# Altium project Dimming_IR_VLC.PrjPcb
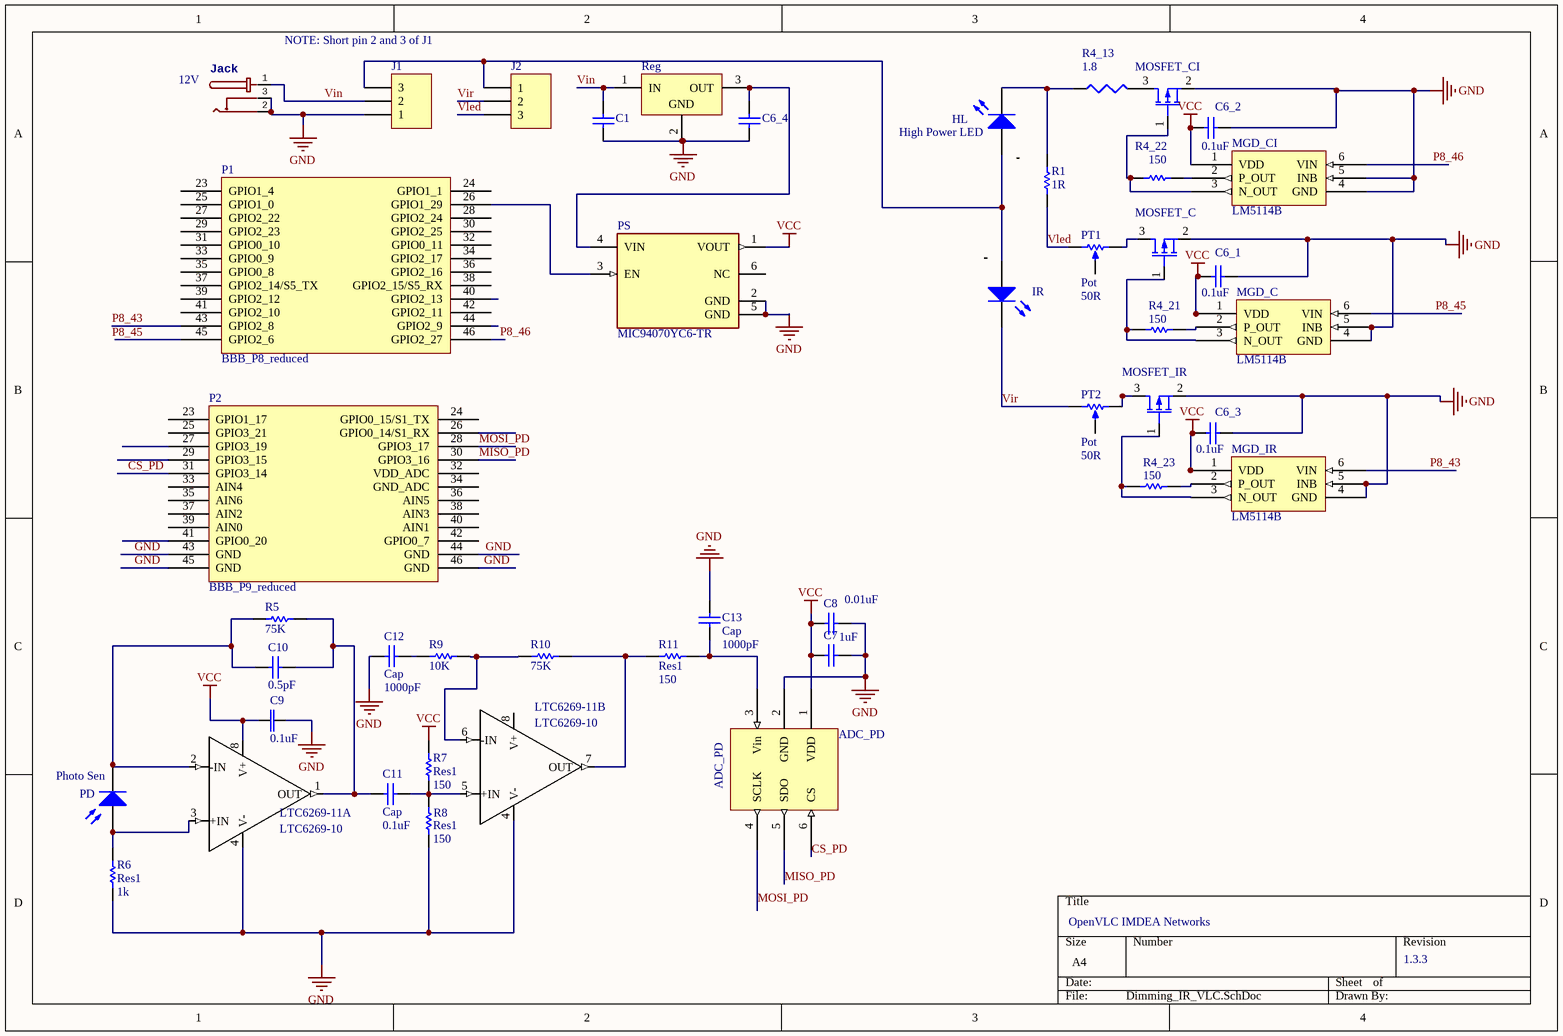
[diagram p0: Dimming_IR_VLC.SchDoc]
1 sheet, 44 parts. Net scope: global (net labels, ports and power ports of the same name join across sheets).
Board file: Dimming_IR_VLC.PcbDoc

## Sheet Dimming_IR_VLC.SchDoc
size A4; SheetNumber: 1; SheetTotal: 1

### Parts
ADC_PD  ADC_PD  [SOT23-6]
C1  Cap  [1608[0603]]  (value not drawn)
C6_1  value 0.1uF  [1608[0603]]  (hidden comment: Cap)
C6_2  value 0.1uF  [1608[0603]]  (hidden comment: Cap)
C6_3  value 0.1uF  [1608[0603]]  (hidden comment: Cap)
C6_4  Cap  [1608[0603]]  (value not drawn)
C7  value 1uF  [1608[0603]]  (hidden comment: Cap)
C8  value 0.01uF  [1608[0603]]  (hidden comment: Cap)
C9  value 0.1uF  [1608[0603]]  (hidden comment: Cap)
C10  value 0.5pF  [1608[0603]]  (hidden comment: Cap)
C11  Cap  value 0.1uF  [1608[0603]]
C12  Cap  value 1000pF  [1608[0603]]
C13  Cap  value 1000pF  [1608[0603]]
HL  High Power LED  [LEDM345X345X226]
IR  (no value)  [LEDM345X345X226]
J1  (no value)  [MHDR1X3]
J2  (no value)  [MHDR1X3]
Jack  2.0 mm Center Pin, 2.5 A, Right Angle, Through Hole, Tapered Pins, Dc Power Jack Connector  [CUI_PJ-102A]  (value not drawn)
LTC6269-11  LTC6269-10  [SM8]  (parts A,B of 2)
MGD_C  LM5114B  [SOT23-6_N]
MGD_CI  LM5114B  [SOT23-6_N]
MGD_IR  LM5114B  [SOT23-6_N]
MOSFET_C  MOSFET  [SOT23-3]  (value not drawn)
MOSFET_CI  MOSFET  [SOT23-3]  (value not drawn)
MOSFET_IR  MOSFET  [SOT23-3]  (value not drawn)
P1  BBB_P8_reduced  [BBB_CAPE_NO_HEADER_R_24]
P2  BBB_P9_reduced  [BBB_CAPE_NO_HEADER_R_24]
PD  Photo Sen  [HDR1X2]
PS  MIC94070YC6-TR  [FP-SC70-6LD-PL-1-IPC_A]
PT1  Pot  value 50R  [VR5]
PT2  Pot  value 50R  [VR5]
R1  1R  [1608[0603]]
R4_13  value 1.8  [14-1210]  (hidden comment: Res3)
R4_21  value 150  [1608[0603]]  (hidden comment: Res1)
R4_22  value 150  [1608[0603]]  (hidden comment: Res1)
R4_23  value 150  [1608[0603]]  (hidden comment: Res1)
R5  value 75K  [1608[0603]]  (hidden comment: Res1)
R6  Res1  value 1k  [1608[0603]]
R7  Res1  value 150  [1608[0603]]
R8  Res1  value 150  [1608[0603]]
R9  value 10K  [1608[0603]]  (hidden comment: Res1)
R10  value 75K  [1608[0603]]  (hidden comment: Res1)
R11  Res1  value 150  [1608[0603]]
Reg  LM340T-5.0  [NDE0003A]  (value not drawn)

### Nets
GND: ADC_PD.2(GND) C1.1 C6_1.2 C6_2.2 C6_3.2 C6_4.1 C7.2 C8.2 C9.1 C12.1 C13.2 J1.1 Jack.2 Jack.3 LTC6269-11.4(V-) MGD_C.4(GND) MGD_C.5(INB) MGD_CI.4(GND) MGD_CI.5(INB) MGD_IR.4(GND) MGD_IR.5(INB) MOSFET_C.2(S) MOSFET_CI.2(S) MOSFET_IR.2(S) P2.43(GND) P2.44(GND) P2.45(GND) P2.46(GND) PS.2(GND) PS.5(GND) R6.1 R8.1 Reg.2(GND)
VCC: ADC_PD.1(VDD) C6_1.1 C6_2.1 C6_3.1 C7.1 C8.1 C9.2 LTC6269-11.8(V+) MGD_C.1(VDD) MGD_CI.1(VDD) MGD_IR.1(VDD) PS.1(VOUT) R7.2
CS_PD: ADC_PD.6(CS) P2.31(GPIO3_14)
MISO_PD: ADC_PD.5(SDO) P2.30(GPIO3_16)
MOSI_PD: ADC_PD.4(SCLK) P2.28(GPIO3_17)
P8_43: MGD_IR.6(VIN) P1.43(GPIO2_8)
P8_45: MGD_C.6(VIN)
P8_46: MGD_CI.6(VIN) P1.46(GPIO2_27)
Vin: C1.2 J1.2 Jack.1 Reg.1(IN)
Vir: IR.2(K) J2.2 PT2.1(TOP)
Vled: J2.3 PT1.1(TOP) R1.1
NetADC_PD_3: ADC_PD.3(Vin) C13.1 R11.1
NetC6_4_2: C6_4.2 PS.4(VIN) Reg.3(OUT)
NetC10_1: C10.1 LTC6269-11.2(-IN) PD.2(K) R5.1
NetC10_2: C10.2 C11.1 LTC6269-11.1(OUT) R5.2
NetC11_2: C11.2 LTC6269-11.5(+IN) R7.1 R8.2
NetC12_2: C12.2 R9.2
NetHL_1: HL.1(A) IR.1(A) J1.3 J2.1
NetHL_2: HL.2(K) R1.2 R4_13.1
NetLTC6269-11_3: LTC6269-11.3(+IN) PD.1(A) R6.2
NetLTC6269-11_6: LTC6269-11.6(-IN) R9.1 R10.2
NetLTC6269-11_7: LTC6269-11.7(OUT) R10.1 R11.2
NetMGD_C_2: MGD_C.2(P_OUT) R4_21.2
NetMGD_C_3: MGD_C.3(N_OUT) MOSFET_C.1(G) R4_21.1
NetMGD_CI_2: MGD_CI.2(P_OUT) R4_22.2
NetMGD_CI_3: MGD_CI.3(N_OUT) MOSFET_CI.1(G) R4_22.1
NetMGD_IR_2: MGD_IR.2(P_OUT) R4_23.2
NetMGD_IR_3: MGD_IR.3(N_OUT) MOSFET_IR.1(G) R4_23.1
NetMOSFET_C_3: MOSFET_C.3(D) PT1.2(BOT)
NetMOSFET_CI_3: MOSFET_CI.3(D) R4_13.2
NetMOSFET_IR_3: MOSFET_IR.3(D) PT2.2(BOT)
NetP1_26: P1.26(GPIO1_29) PS.3(EN)

Not connected (* = marked no-connect by the designer): HL 3(Thermal); IR 3(Thermal); P1 23(GPIO1_4) 24(GPIO1_1) 25(GPIO1_0) 27(GPIO2_22) 28(GPIO2_24) 29(GPIO2_23) 30(GPIO2_25) 31(GPIO0_10) 32(GPIO0_11) 33(GPIO0_9) 34(GPIO2_17) 35(GPIO0_8) 36(GPIO2_16) 37(GPIO2_14/S5_TX) 38(GPIO2_15/S5_RX) 39(GPIO2_12) 40(GPIO2_13) 41(GPIO2_10) 42(GPIO2_11) 44(GPIO2_9) 45(GPIO2_6); P2 23(GPIO1_17) 24(GPIO0_15/S1_TX) 25(GPIO3_21) 26(GPIO0_14/S1_RX) 27(GPIO3_19) 29(GPIO3_15) 32(VDD_ADC) 33(AIN4) 34(GND_ADC) 35(AIN6) 36(AIN5) 37(AIN2) 38(AIN3) 39(AIN0) 40(AIN1) 41(GPIO0_20) 42(GPIO0_7); PS 6(NC); PT1 3(TAP); PT2 3(TAP)

### Notes on the sheet
- NOTE: Short pin 2 and 3 of J1
- 12V
- OpenVLC IMDEA Networks
- 1.3.3
- Labels drawn without touching a wire or pin: P8_45

### Library data of the parts
ADC_PD = ADS7883
C1 = Cap: Capacitor; Value: 0.22uF; Published: 8-Jun-2000; LatestRevisionDate: 17-Jul-2002; LatestRevisionNote: Re-released for DXP Platform.; PackageReference: RAD-0.3; Publisher: Altium Limited; PackageDescription: Radial Cap, Thru-Hole; 2 Leads; 0.3 in Pin Spacing
C6_1-C6_3 C7-C13 = Cap: Capacitor; Published: 8-Jun-2000; LatestRevisionDate: 17-Jul-2002; LatestRevisionNote: Re-released for DXP Platform.; PackageReference: RAD-0.3; Publisher: Altium Limited
  C6_1-C6_3 C7 C8 C10-C13: PackageDescription: Radial Cap, Thru-Hole; 2 Leads; 0.3 in Pin Spacing
C6_4 = Cap: Capacitor; Value: 0.1uF; Published: 8-Jun-2000; LatestRevisionDate: 17-Jul-2002; LatestRevisionNote: Re-released for DXP Platform.; PackageReference: RAD-0.3; Publisher: Altium Limited; PackageDescription: Radial Cap, Thru-Hole; 2 Leads; 0.3 in Pin Spacing
HL IR = LED1: Typical RED GaAs LED; Published: 8-Jun-2000; LatestRevisionDate: 08-Jul-2005; LatestRevisionNote: Mech Layer 1 removed.; PackageReference: LED-1; Publisher: Altium Limited; PackageDescription: LED; 2 Leads
J1 J2 = MHDR1X3: Header, 3-Pin; LatestRevisionDate: 17-Jul-2002; LatestRevisionNote: Re-released for DXP Platform.; Publisher: Altium Limited
Jack = PJ-102A: MF: CUI; MP: PJ-102A; Price: 0.41 USD; Package: None; Availability: Good
MGD_C MGD_CI MGD_IR = LM5114B: MOSFET Gate Driver
MOSFET_C MOSFET_CI MOSFET_IR = MOSFET-P: P-Channel MOSFET; Published: 8-Jun-2000; LatestRevisionDate: 17-Jul-2002; LatestRevisionNote: Re-released for DXP Platform.; PackageVersion: 1995/1996; PackageReference: E3; Publisher: Altium Limited
PD = Photo Sen: Photosensitive Diode; Published: 24-Mar-1999; LatestRevisionDate: 17-Jul-2002; LatestRevisionNote: Re-released for DXP Platform.; PackageReference: PIN2; Publisher: Altium Limited
PS = CMP-06320-000034-1: IC PWR SWITCH P-CHAN 1:1 SC70-6; Min Supply Voltage: 1.7V; Output Current: 1.2A; Max Input Voltage: 5.5V; Number of Outputs: 1; On-State Resistance: 120mR; Output Configuration: High Side; Interface: On/Off; Min Operating Temperature: -40°C; Series: -; Termination: SMD/SMT; Length: 2.2mm; Max Output Current: 1.2A; Max Operating Temperature: 125°C; Max Supply Voltage: 5.5V; Reach SVHC Compliant: Yes; Width: 1.35mm; RoHS Compliant: Yes; Height: 1mm; Min Input Voltage: 1.7V; Package Quantity: 3000; Packaging: Tape and Reel; Mount: Surface Mount; Number of Pins: 6; Case/Package: SC
PT1 PT2 = RPot: Potentiometer; Sim Note: Enter the Resistance value and the set point into parameter fields.; Set Position: 0.5; Published: 8-Jun-2000; LatestRevisionDate: 17-Jul-2002; LatestRevisionNote: Re-released for DXP Platform.; PackageReference: VR5; Publisher: Altium Limited; PackageDescription: Variable Resistor, Thru-Hole; 3 Leads
R1 R4_21-R4_23 R5-R11 = Res1: Resistor; Published: 8-Jun-2000; LatestRevisionDate: 17-Jul-2002; LatestRevisionNote: Re-released for DXP Platform.; PackageReference: AXIAL-0.3; Publisher: Altium Limited; PackageDescription: Axial Device, Thru-Hole; 2 Leads; 0.3 in Pin Spacing
  R1: Value: 1R
R4_13 = Res3: Resistor; Published: 8-Jun-2000; LatestRevisionDate: 29-May-2009; LatestRevisionNote: IPC-7351 Footprint Added.; PackageReference: J1-0603; Publisher: Altium Limited; PackageDescription: Chip Resistor
Reg = CMP-0062-02468-3: Series 3-Terminal Positive Regulators, 3-pin TO-220; Manufacturer: Texas Instruments; PowerWise: N; CompType: LDO IC; PackageTopMarking: NSUZXYTTE#*LM340T5*7805 P+; RoHS: N; ComponentLink1URL: http://www.ti.com/general/docs/lit/getliterature.tsp?genericPartNumber=LM340-N&fileType=pdf; PinCount: 3; PackageReference: NDE0003A; ComponentLink1Description: Datasheet URL; PackageDescription: TO-220, Molded, 3 Lead, Straight